# Altium schematic sheet full_as.SchDoc
size A; SheetNumber: 1; SheetTotal: 1
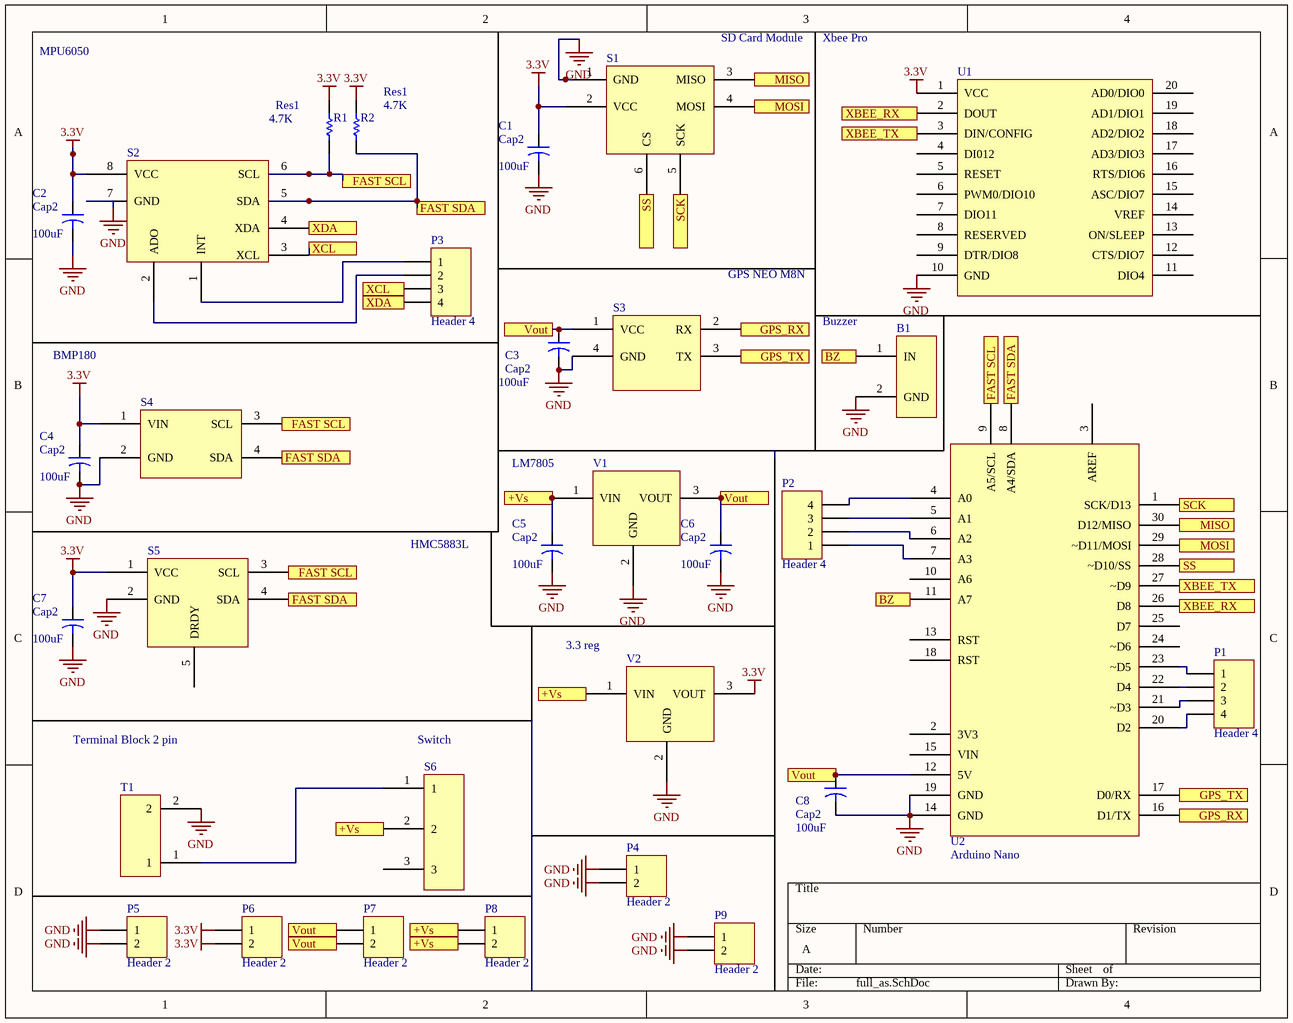
[diagram p0: full_as.SchDoc]

## Parts
B1  Buzzer  [BUZZER]
C1  Cap2  value 100uF  [CAPR5-4X5]
C2  Cap2  value 100uF  [CAPR5-4X5]
C3  Cap2  value 100uF  [CAPR5-4X5]
C4  Cap2  value 100uF  [CAPR5-4X5]
C5  Cap2  value 100uF  [CAPR5-4X5]
C6  Cap2  value 100uF  [CAPR5-4X5]
C7  Cap2  value 100uF  [CAPR5-4X5]
C8  Cap2  value 100uF  [CAPR5-4X5]
P1  Header 4  [HDR1X4]
P2  Header 4  [HDR1X4]
P3  Header 4  [HDR1X4]
P4  Header 2  [HDR1X2]
P5  Header 2  [HDR1X2]
P6  Header 2  [HDR1X2]
P7  Header 2  [HDR1X2]
P8  Header 2  [HDR1X2]
P9  Header 2  [HDR1X2]
R1  Res1  value 4.7K  [AXIAL-0.3]
R2  Res1  value 4.7K  [AXIAL-0.3]
S1  SD Card Module  [SD Card Module]
S2  MPU6050  [MPU6050]
S3  GPS NEO M8N  [GPS NEO M8N]
S4  BMP180  [BMP180]
S5  HMC5883L  [HMC5883L]
S6  Switch  [Switch]
T1  Terminal Block 2 pin  [Terminal Block 2 pin]
U1  Xbee Pro  [Xbee]
U2  Arduino Nano  [ARDUINO NANO v3]
V1  LM7805  [LM7805 Voltage Regulator]
V2  3.3 reg  [LM7805 Voltage Regulator]

## Ports
+Vs, BZ, FAST SCL, FAST SDA, GPS_RX, GPS_TX, MISO, MOSI, SCK, SS, Vout, XBEE_RX, XBEE_TX, XCL, XDA

## Nets
3.3V: C1.1 C2.1 C4.1 C7.1 P6.1 P6.2 R1.2 R2.2 S1.2(VCC) S2.8(VCC) S4.1(VIN) S5.1(VCC) U1.1(VCC) V2.3(VOUT)
GND: B1.2(GND) C1.2 C2.2 C3.2 C4.2 C5.2 C6.2 C7.2 C8.2 P4.1 P4.2 P5.1 P5.2 P9.1 P9.2 S1.1(GND) S2.7(GND) S3.4(GND) S4.2(GND) S5.2(GND) T1.2 U1.10(GND) U2.14(GND) U2.19(GND) V1.2(GND) V2.2(GND)
+Vs: C5.1 P8.1 P8.2 S6.2 V1.1(VIN) V2.1(VIN) ; port +Vs
BZ: B1.1(IN) U2.11(A7) ; port BZ
FAST SCL: R1.1 S2.6(SCL) S4.3(SCL) S5.3(SCL) U2.9(A5/SCL) ; port FAST SCL
FAST SDA: R2.1 S2.5(SDA) S4.4(SDA) S5.4(SDA) U2.8(A4/SDA) ; port FAST SDA
GPS_RX: S3.2(RX) U2.16(D1/TX) ; port GPS_RX
GPS_TX: S3.3(TX) U2.17(D0/RX) ; port GPS_TX
MISO: S1.3(MISO) U2.30(D12/MISO) ; port MISO
MOSI: S1.4(MOSI) U2.29(~D11/MOSI) ; port MOSI
SCK: S1.5(SCK) U2.1(SCK/D13) ; port SCK
SS: S1.6(CS) U2.28(~D10/SS) ; port SS
Vout: C3.1 C6.1 C8.1 P7.1 P7.2 S3.1(VCC) U2.12(5V) V1.3(VOUT) ; port Vout
XBEE_RX: U1.2(DOUT) U2.26(D8) ; port XBEE_RX
XBEE_TX: U1.3(DIN/CONFIG) U2.27(~D9) ; port XBEE_TX
XCL: P3.3 S2.3(XCL) ; port XCL
XDA: P3.4 S2.4(XDA) ; port XDA
NetP1_1: P1.1 U2.23(~D5)
NetP1_2: P1.2 U2.22(D4)
NetP1_3: P1.3 U2.21(~D3)
NetP1_4: P1.4 U2.20(D2)
NetP2_1: P2.1 U2.7(A3)
NetP2_2: P2.2 U2.6(A2)
NetP2_3: P2.3 U2.5(A1)
NetP2_4: P2.4 U2.4(A0)
NetP3_1: P3.1 S2.1(INT)
NetP3_2: P3.2 S2.2(ADO)
NetS6_1: S6.1 T1.1

Not connected (* = marked no-connect by the designer): S5 5(DRDY); S6 3; U1 4(DI012) 5(RESET) 6(PWM0/DIO10) 7(DIO11) 8(RESERVED) 9(DTR/DIO8) 11(DIO4) 12(CTS/DIO7) 13(ON/SLEEP) 14(VREF) 15(ASC/DIO7) 16(RTS/DIO6) 17(AD3/DIO3) 18(AD2/DIO2) 19(AD1/DIO1) 20(AD0/DIO0); U2 2(3V3) 3(AREF) 10(A6) 13(RST) 15(VIN) 18(RST) 24(~D6) 25(D7)

## Library data of the parts
B1 = Buzzer: Buzzer audio
C1-C8 = Cap2: Capacitor; Published: 23-Sep-2002; PackageReference: CAPR5-4X5; Publisher: Altium Limited; PackageDescription: Capacitor; 2 Leads
P1-P3 = Header 4: Header, 4-Pin; LatestRevisionDate: 17-Jul-2002; LatestRevisionNote: Re-released for DXP Platform.; Publisher: Altium Limited
P4-P9 = Header 2: Header, 2-Pin; LatestRevisionDate: 17-Jul-2002; LatestRevisionNote: Re-released for DXP Platform.; Publisher: Altium Limited
R1 R2 = Res1: Resistor; Published: 8-Jun-2000; LatestRevisionDate: 17-Jul-2002; LatestRevisionNote: Re-released for DXP Platform.; PackageReference: AXIAL-0.3; Publisher: Altium Limited; PackageDescription: Axial Device, Thru-Hole; 2 Leads; 0.3 in Pin Spacing
S2 = MPU6050: MPU6050 Gyro Sensor PCB
S4 = BMP180: BMP180 Pressure Sensor
S5 = HMC5883L: HMC58883L Digital Compass
S6 = Switch: Slide Switch 4mm pitch
T1 = Terminal Block 2 pin: Terminal Block 2 pin (5mm)
U1 = Xbee Pro: Xbee Pro 90HP
U2 = Arduino Nano: Arduino Nano v3
V1 = LM7805: LM7805 5V Voltage Regulator